# Altium schematic sheet Mechanical.SchDoc: Mechanical Parts
size A; Author: Craig Hesling; DrawnBy: Craig Hesling; Revision: 1
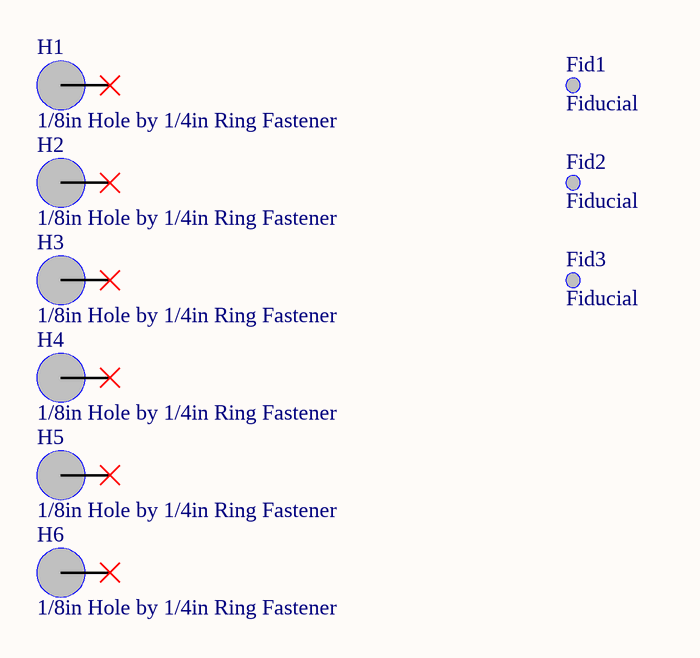
[diagram p0: Mechanical.SchDoc]

## Parts
Fid1  Fiducial  [Fiducial 1mm]
Fid2  Fiducial  [Fiducial 1mm]
Fid3  Fiducial  [Fiducial 1mm]
H1  1/8in Hole by 1/4in Ring Fastener  [1/8in Fastener Hole]
H2  1/8in Hole by 1/4in Ring Fastener  [1/8in Fastener Hole]
H3  1/8in Hole by 1/4in Ring Fastener  [1/8in Fastener Hole]
H4  1/8in Hole by 1/4in Ring Fastener  [1/8in Fastener Hole]
H5  1/8in Hole by 1/4in Ring Fastener  [1/8in Fastener Hole]
H6  1/8in Hole by 1/4in Ring Fastener  [1/8in Fastener Hole]

## Nets

Not connected (* = marked no-connect by the designer): H1 1*; H2 1*; H3 1*; H4 1*; H5 1*; H6 1*

## Library data of the parts
Fid1-Fid3 = Fiducial 1mm: 1mm Fiducial Mark
H1-H6 = 1/8in by 1/4in Fastner Hole